# EAGLE schematic Console Main Ctl Board v2 (EAGLE 9.6.2)
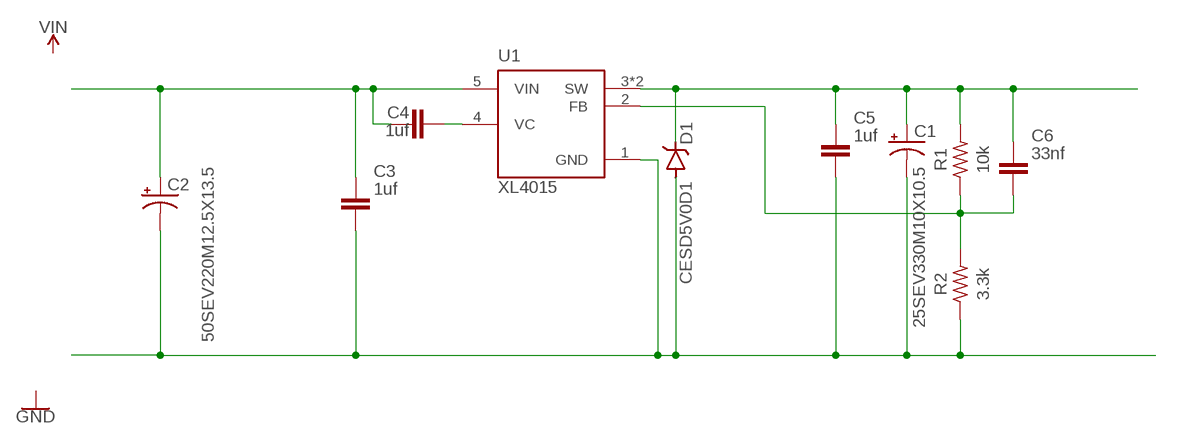
[diagram p0: schematic, sheet 1]

## Parts
C1  25SEV330M10X10.5  [CAP_J-V_10X10P5_RUB]
C2  50SEV220M12.5X13.5  [CAP_S-V_12P5X13P5_RUB]
C3  1uf  C_CHIP-1206(3216-METRIC)  [CAPC3216X135]
C4  1uf  C_CHIP-1206(3216-METRIC)  [CAPC3216X135]
C5  1uf  C_CHIP-1206(3216-METRIC)  [CAPC3216X135]
C6  33nf  C_CHIP-1206(3216-METRIC)  [CAPC3216X135]
D1  CESD5V0D1  [SOD-123]
R1  10k  R-US_CHIP-1206(3216-METRIC)  [RESC3216X70]
R2  3.3k  R-US_CHIP-1206(3216-METRIC)  [RESC3216X70]
U1  XL4015  [CONV_XL4015]

## Nets
N$1: C1.2(-) C2.2(-) C3.2 C5.2 D1.A R2.1 U1.1(GND)
N$2: C6.2 R1.1 R2.2 U1.2(FB)
N$3: C1.1(+) C5.1 C6.1 D1.C R1.2 U1.3(SW) U1.3.1(SW)
N$4: C2.1(+) C3.1 C4.1 U1.5(VIN)
N$6: C4.2 U1.4(VC)

## Library data of the parts
C1 = Nathan Custom:25SEV330M10X10.5; COPYRIGHT: Copyright (C) 2021 Ultra Librarian. All rights reserved.; DIGI-KEY_PART_NUMBER_1: 1189-2430-1-ND; DIGI-KEY_PART_NUMBER_2: 1189-2430-2-ND; DIGI-KEY_PART_NUMBER_3: 1189-2430-6-ND; MANUFACTURER_PART_NUMBER: 25SEV330M10X10.5; MFR_NAME: Rubycon
C2 = Nathan Custom:50SEV220M12.5X13.5; COPYRIGHT: Copyright (C) 2021 Ultra Librarian. All rights reserved.; DIGI-KEY_PART_NUMBER_1: 1189-3100-1-ND; DIGI-KEY_PART_NUMBER_2: 1189-3100-2-ND; DIGI-KEY_PART_NUMBER_3: 1189-3100-6-ND; MANUFACTURER_PART_NUMBER: 50SEV220M12.5X13.5; MFR_NAME: Rubycon
C3-C6 = Capacitor:C: Capacitor - Generic; CATEGORY: Capacitor
D1 = Diodes:CESD5V0D1: SOD-123 Plastic-Encapsulate Diodes Uni-direction ESD Protection Diode Manufacturer's datasheet <https://seeeddoc.github.io/Open_parts_library/res/304060001.pdf>; CREATED_BY: PCBLayout.com; MANUFACTURER: JCET; MPN: CESD5V0D1; PACKAGE: SOD-123
R1 R2 = Resistor:R-US: Resistor Fixed - ANSI; CATEGORY: Resistor; SUB-CATEGORY: Fixed
U1 = Nathan Custom:XL4015: 5A 180KHz 36V Buck DC to DC Converter Check prices <https://pricing.snapeda.com/parts/XL4015/XLSEMI/view-part?ref=eda>; AVAILABILITY: Not in stock; DESCRIPTION: 5A 180KHz 36V Buck DC to DC Converter; MF: XLSEMI; MP: XL4015; PACKAGE: Package; PRICE: None